# Altium schematic sheet Measurment ICs.SchDoc
size 420 x 297 mm; SheetNumber: 3; SheetTotal: 4
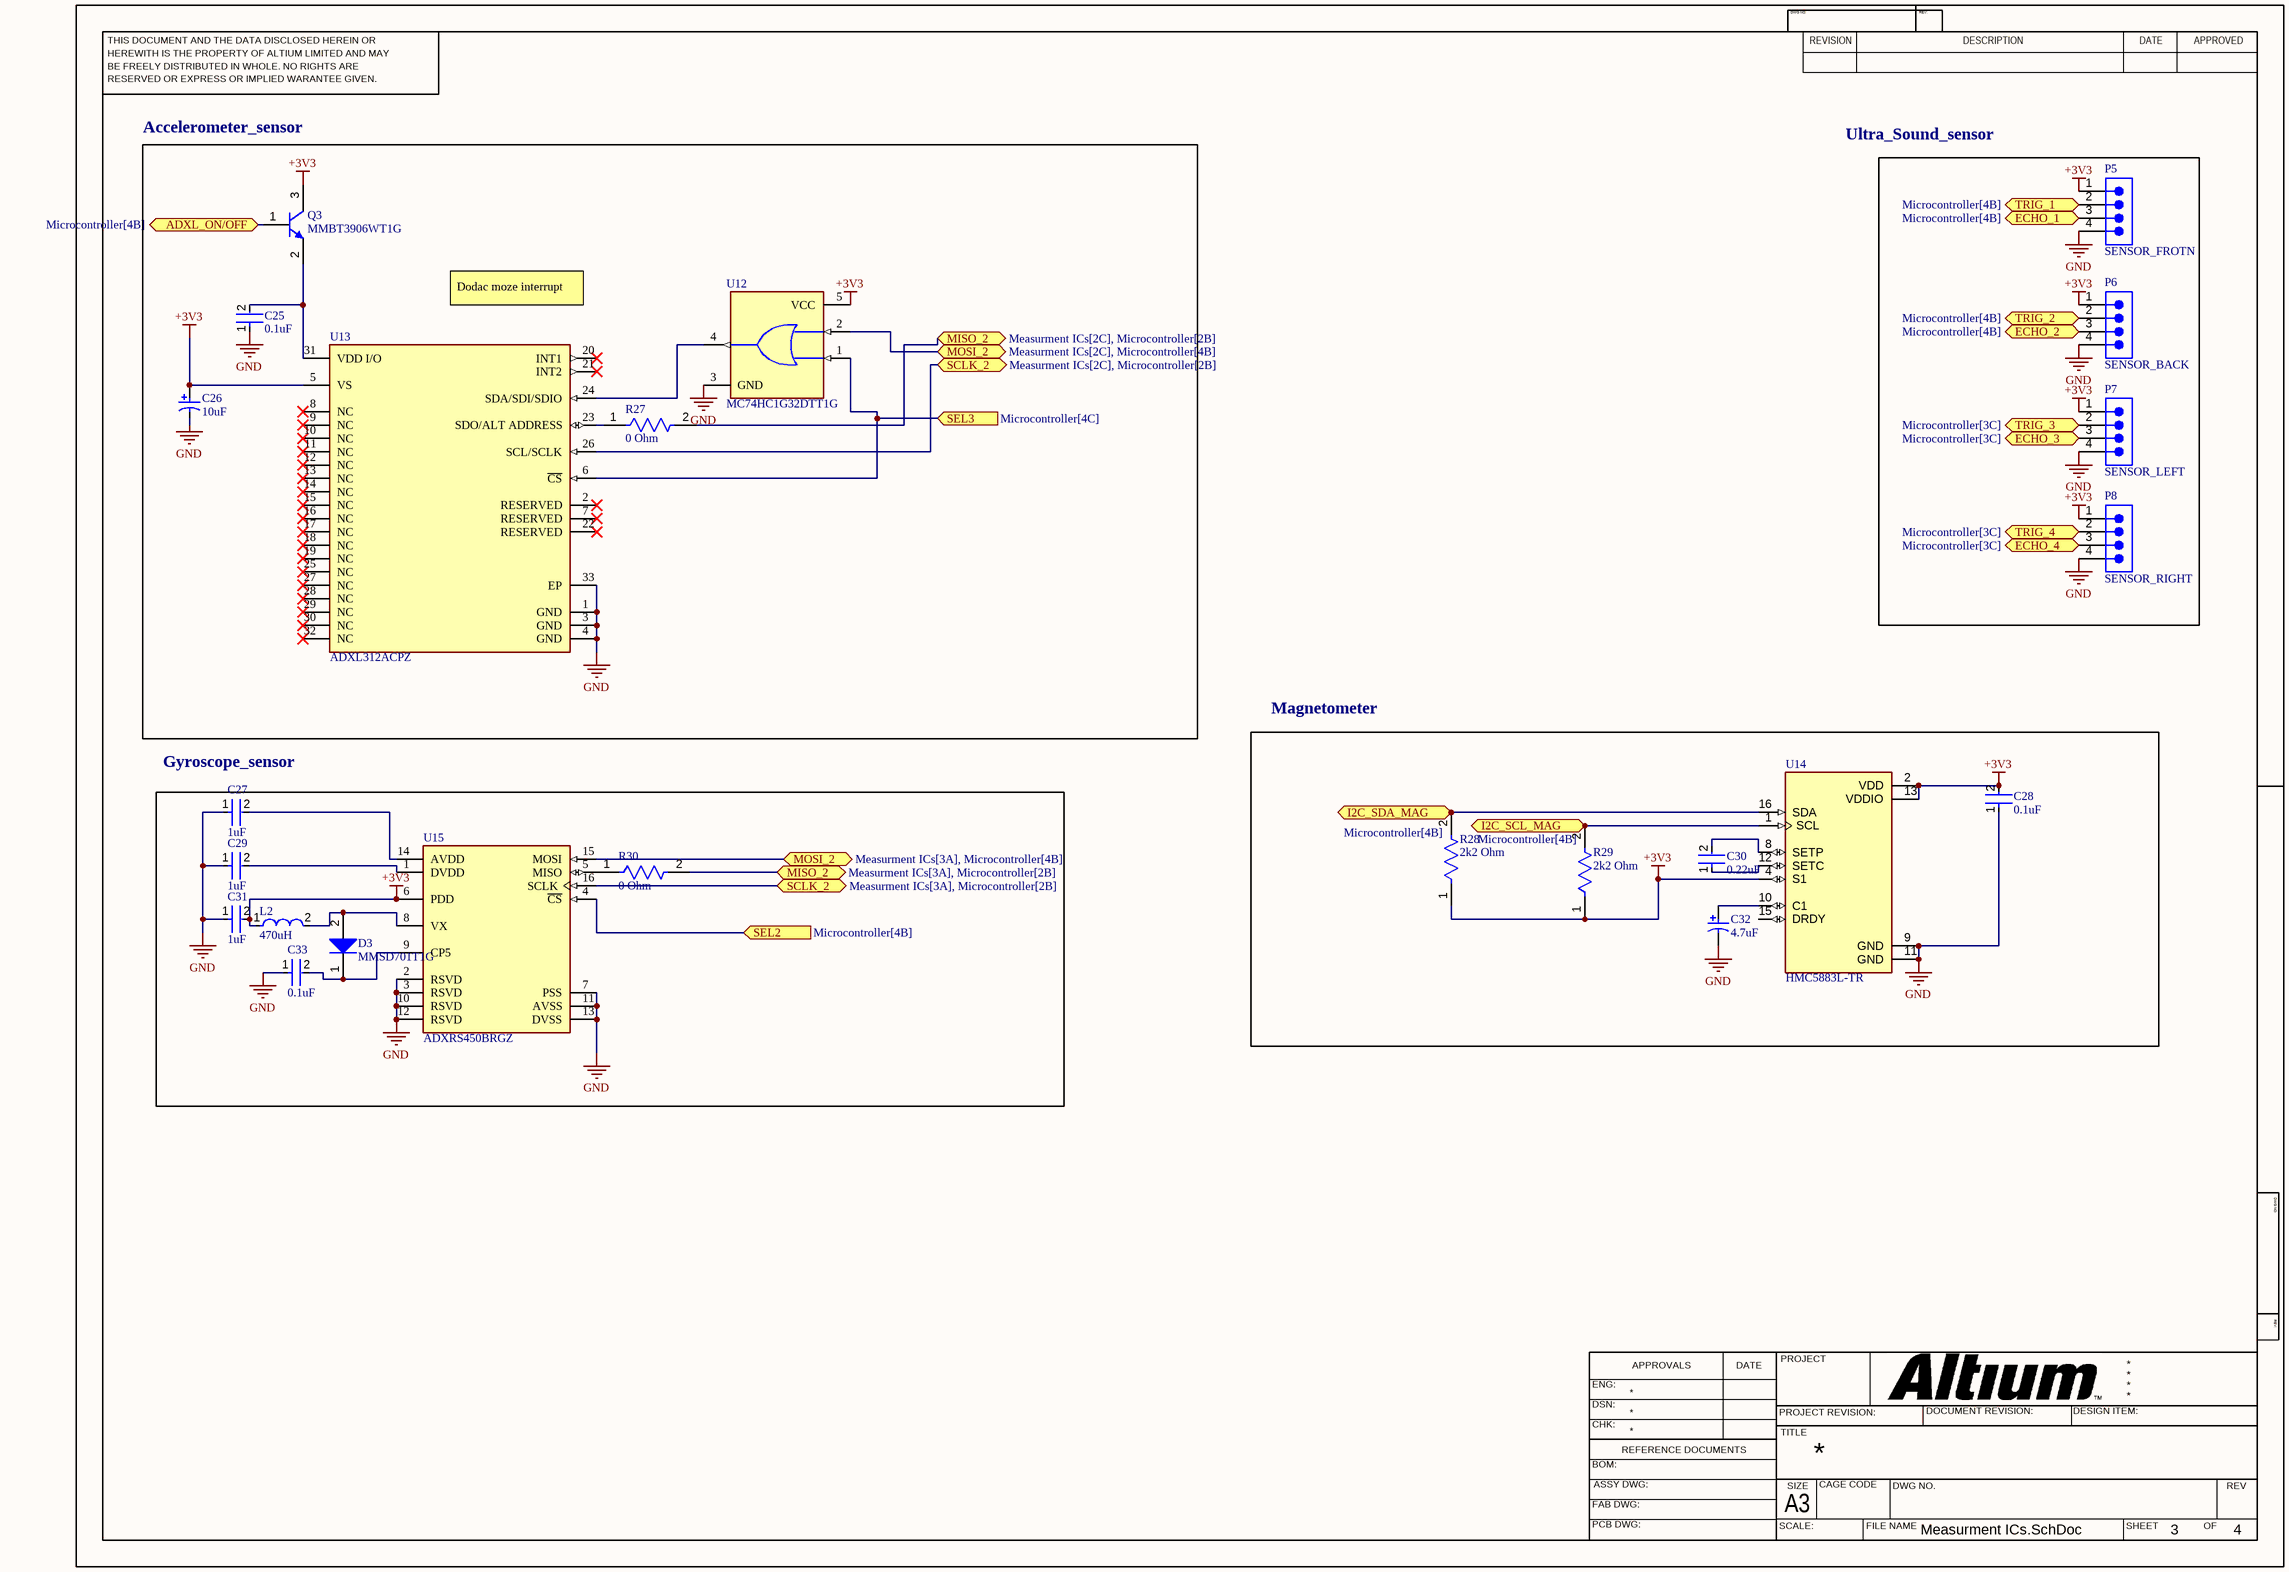
[diagram p0: Measurment ICs.SchDoc]

## Parts
C25  0.1uF  [FP-CC0805-0_85-MFG]
C26  10uF  [KEMT-A-3216-18-2_M]
C27  1uF  [FP-CC0805-0_85-MFG]
C28  0.1uF  [FP-CC0805-0_85-MFG]
C29  1uF  [FP-CC0805-0_85-MFG]
C30  0.22uF  [FP-CC0805-0_85-MFG]
C31  1uF  [FP-CC0805-0_85-MFG]
C32  4.7uF  [PNSC-FK-V-D8_V]
C33  0.1uF  [FP-CC0805-0_85-MFG]
D3  MMSD701T1G  [ONSC-SOD-123-2-425-04_V]
L2  470uH  [FP-CB2518-MFG]
P5  SENSOR_FROTN  [61300411121]
P6  SENSOR_BACK  [61300411121]
P7  SENSOR_LEFT  [61300411121]
P8  SENSOR_RIGHT  [61300411121]
Q3  MMBT3906WT1G  [ONSC-SC-70-3-419-04_V]
R27  0 Ohm  [FP-RMCF0805-MFG]
R28  2k2 Ohm  [FP-RMCF0805-MFG]
R29  2k2 Ohm  [FP-RMCF0805-MFG]
R30  0 Ohm  [FP-RMCF0805-MFG]
U12  MC74HC1G32DTT1G  [FP-483-MFG]
U13  ADXL312ACPZ  [FP-CP-32-17-MFG]
U14  HMC5883L-TR  [XDCR_HMC5883L-TR]
U15  ADXRS450BRGZ  [FP-RG-16-1-IPC_C]

## Blocks framed on the sheet
Magnetometer: C28 C30 C32 R28 R29 U14

## Ports
ADXL_ON/OFF (bidir, see Microcontroller[4B]), ECHO_1 (bidir, see Microcontroller[4B]), ECHO_2 (bidir, see Microcontroller[4B]), ECHO_3 (bidir, see Microcontroller[3C]), ECHO_4 (bidir, see Microcontroller[3C]), I2C_SCL_MAG (bidir, see Microcontroller[4B]), I2C_SDA_MAG (bidir, see Microcontroller[4B]), MISO_2 (bidir, see Measurment ICs[2C], Microcontroller[2B]), MISO_2 (bidir, see Measurment ICs[3A], Microcontroller[2B]), MOSI_2 (bidir, see Measurment ICs[2C], Microcontroller[4B]), MOSI_2 (bidir, see Measurment ICs[3A], Microcontroller[4B]), SCLK_2 (bidir, see Measurment ICs[2C], Microcontroller[2B]), SCLK_2 (bidir, see Measurment ICs[3A], Microcontroller[2B]), SEL2 (in, see Microcontroller[4B]), SEL3 (in, see Microcontroller[4C]), TRIG_1 (bidir, see Microcontroller[4B]), TRIG_2 (bidir, see Microcontroller[4B]), TRIG_3 (bidir, see Microcontroller[3C]), TRIG_4 (bidir, see Microcontroller[3C])

## Nets
+3V3: C26.1 C28.2 C31.2 L2.1 P5.1 P6.1 P7.1 P8.1 Q3.3(C) R28.1 R29.1 U12.5(VCC) U13.5(VS) U14.2(VDD) U14.4(S1) U14.13(VDDIO) U15.6(PDD)
GND: C25.1 C26.2 C27.1 C28.1 C29.1 C31.1 C32.2 C33.1 P5.4 P6.4 P7.4 P8.4 U12.3(GND) U13.1(GND) U13.3(GND) U13.4(GND) U13.33(EP) U14.9(GND) U14.11(GND) U15.2(RSVD) U15.3(RSVD) U15.7(PSS) U15.10(RSVD) U15.11(AVSS) U15.12(RSVD) U15.13(DVSS)
ADXL_ON/OFF: Q3.1(B) ; port ADXL_ON/OFF
ECHO_1: P5.3 ; port ECHO_1
ECHO_2: P6.3 ; port ECHO_2
ECHO_3: P7.3 ; port ECHO_3
ECHO_4: P8.3 ; port ECHO_4
I2C_SCL_MAG: R29.2 U14.1(SCL) ; port I2C_SCL_MAG
I2C_SDA_MAG: R28.2 U14.16(SDA) ; port I2C_SDA_MAG
MISO_2: R27.2 R30.2 ; port MISO_2
MOSI_2: U12.2(A) U15.15(MOSI) ; port MOSI_2
SCLK_2: U13.26(SCL/SCLK) U15.16(SCLK) ; port SCLK_2
SEL2: U15.4(~{CS}) ; port SEL2
SEL3: U12.1(B) U13.6(~{CS}) ; port SEL3
TRIG_1: P5.2 ; port TRIG_1
TRIG_2: P6.2 ; port TRIG_2
TRIG_3: P7.2 ; port TRIG_3
TRIG_4: P8.2 ; port TRIG_4
NetC25_2: C25.2 Q3.2(E) U13.31(VDD_I/O)
NetC27_2: C27.2 U15.14(AVDD)
NetC29_2: C29.2 U15.1(DVDD)
NetC30_1: C30.1 U14.12(SETC)
NetC30_2: C30.2 U14.8(SETP)
NetC32_1: C32.1 U14.10(C1)
NetC33_2: C33.2 D3.1(K) U15.9(CP5)
NetD3_2: D3.2(A) L2.2 U15.8(VX)
NetR27_1: R27.1 U13.23(SDO/ALT_ADDRESS)
NetR30_1: R30.1 U15.5(MISO)
NetU12_4: U12.4(Y) U13.24(SDA/SDI/SDIO)

Not connected (* = marked no-connect by the designer): U13 2(RESERVED)* 7(RESERVED)* 8(NC)* 9(NC)* 10(NC)* 11(NC)* 12(NC)* 13(NC)* 14(NC)* 15(NC)* 16(NC)* 17(NC)* 18(NC)* 19(NC)* 20(INT1)* 21(INT2)* 22(RESERVED)* 25(NC)* 27(NC)* 28(NC)* 29(NC)* 30(NC)* 32(NC)*; U14 15(DRDY)

## Notes on the sheet
- Accelerometer_sensor
- Ultra_Sound_sensor
- Dodac moze interrupt
- (near C27) Gyroscope_sensor
- THIS DOCUMENT AND THE DATA DISCLOSED HEREIN OR
- HEREWITH IS THE PROPERTY OF ALTIUM LIMITED AND MAY
- DWG NO:
- REVISION
- REV:
- DESCRIPTION
- DATE
- APPROVED
- BE FREELY DISTRIBUTED IN WHOLE. NO RIGHTS ARE
- RESERVED OR EXPRESS OR IMPLIED WARANTEE GIVEN.
- ENG:
- APPROVALS
- PROJECT
- DSN:
- CHK:
- REFERENCE DOCUMENTS
- PROJECT REVISION:
- TITLE
- DOCUMENT REVISION:
- DESIGN ITEM:
- BOM:
- FAB DWG:
- PCB DWG:
- ASSY DWG:
- SCALE:
- A3
- SIZE
- CAGE CODE
- FILE NAME
- DWG NO.
- SHEET
- OF
- REV

## Library data of the parts
C25 C27-C31 C33 = CMP-2100-03606-3: CAP CER 0.1UF 50V X7R 0805; Manufacturer Part Number: CC0805KRX7R9BB104; Manufacturer: Yageo; Tolerance: 0.1; Capacitance: 100 nF; Value: 100 nF; Material: Ceramic; Device Class L1: Passive Components; ComponentLink2Description: Datasheet; Package: CC0805-0.85; Digikey Description: CAP CER 0.1UF 50V X7R 0805; Device Class L3: Ceramic Capacitors; Temperature: -30°C to +85°C; Temperature Characteristic: X7R; Voltage Rating: 50 V; Height: 0.95mm; RoHS: TRUE; Ipc Land Pattern Name: CAPC200125X85; Device Class L2: Capacitors; Category: Cap; Temperature Range Low: -30°C; Temperature Range High: +85°C; Mouser Description: Multilayer Ceramic Capacitors MLCC - SMD/SMT 100nF 50V X7R 10%; Footprint Url: http://www.yageo.com/exep/pages/download/literatures/UPY-C_GEN_24.pdf; Automotive: No; Octopart: https://octopart.com/cc0805krx7r9bb104-yageo-192993; Lead Free: Yes; ComponentLink2URL: http://www.yageo.com/documents/recent/UPY-GPHC_Y5V_6.3V-to-50V_8.pdf
C26 = CMP-2000-05172-1: Capacitor, Tantalum, 10 uF, +/- 10%, 10 V, -55 to 125 degC, 2-Pin SMD (1206), RoHS, Tape and Reel; Manufacturer Size Code: A; Manufacturer: Kemet; Type: Molded; Online Catalog: T491Series; Other Names: 399-3684-2; Voltage - Rated: 10V; Lifetime @ Temp.: 2000Hrs@85degC; Product Training Modules: CapacitorBasics-TypicalUsesforCapacitorsDeratingGuidelinesforSurfaceMountTantalumCapacitors; ESR (Equivalent Series Resistance): 3.8Ohm; Capacitance: 10µF; Catalog Drawings: T49x,T5xxSeries_A-side1T49x,T5xxSeries_A,B-side2T49x,T5xxSeries_A,SBottom; Family: TantalumCapacitors; Manufacturer URL: http://www.kemet.com/; Datasheet URL: http://www.farnell.com/datasheets/1824869.pdf; Package Reference: 1206; Packaging: Tape&Reel(TR); Series: T491; Operating Temperature: -55degC~125degC; Mounting Type: SurfaceMount; Height - Seated (Max): 0.071"(1.80mm); Package / Case: 1206(3216Metric); Package Description: 2-Pin Surface Mount Device, Body 3.2 x 1.6 mm; Features: GeneralPurpose; Tolerance: ±10%; Lead Spacing: -; Size / Dimension: 0.126"Lx0.063"W(3.20mmx1.60mm); Standard Package: 2,000; Datasheet Version: Apr-14; Category: Capacitors
C32 = CMP-2000-06206-1: Aluminum Electrolytic Capacitor, 100 uF, +/- 20%, 25 V, 2-Pin SMD (Size Code D8), -55 to 105 degC, RoHS, Tape and Reel; Manufacturer: Panasonic; Type: Can; Lifetime@Temperature: 2000Hrs@105°C; Capacitance: 100µF; Rated Voltage: 25V; Ripple Current: 280mA; Impedance: 0.34O; Case Size/Dimension: Ø6.3x7.7mm; Operating Temp-Max: 105°C; Series: FK; Package URL: http://industrial.panasonic.com/cdbs/www-data/pdf/RDE0000/DME0000COL48.pdf; Mounting Technology: SurfaceMount; Package Description: 2-Pin Electrolytic Aluminum Capacitor, Body 6.6 x 6.6 mm; Datasheet Version: 03/2016; Datasheet URL: http://industrial.panasonic.com/cdbs/www-data/pdf/RDE0000/ABA0000C1181.pdf; Manufacturer URL: http://www.panasonic.com/; Package Reference: FK-V-D8; Operating Temp Range: -55to+105°C
D3 = CMP-1055-00417-1: Schottky Barrier Diode, 2-Pin SOD-123, Pb-Free, Tape and Reel; Manufacturer: On Semiconductor; Configuration: Single; Packing: Tape and Reel; PackageDescription: 2-Pin SOD, Body 1.6 x 2.69 mm; DatasheetVersion: Rev. 6; ComponentLink1URL: http://www.onsemi.com/; PackageReference: SOD-123-2-425-04; ComponentLink2Description: Datasheet; ComponentLink2URL: http://www.onsemi.cn/pub_link/Collateral/MMSD301T1-D.PDF; ComponentLink1Description: Manufacturer URL; PackageVersion: Rev. G, 10/2009; Mounting Technology: Surface Mount; PartNumber: MMSD701T1G; ComponentLink3URL: http://www.onsemi.com/pub_link/Collateral/425-04.PDF; ComponentLink3Description: Package Specification; RoHS: TRUE
L2 = CMP-14484-000283-1: SMD Inductors 470uH ±20% 0.07A 28.6Ω 1007; Shielding: Unshielded; DC Resistance (DCR): 28.6R; Current Rating: 70mA; Core Material: Ferrite; Saturation Current: 80mA; Test Frequency: 796kHz; Self Resonant Frequency: 3.5MHz; Packaging: Tape and Reel; Mount: Surface Mount; Case/Package: 1007; Min Operating Temperature: -40°C; Military Standard: Not; RoHS Compliant: Yes; Resistance: 28.6R; Height - Seated (Max): 0.079inch; Case Code (Imperial): 1007; Inductance: 470uH; Max Operating Temperature: 105°C; Halogen Free: Halogen Free; Package Quantity: 2000; Series: CB; Case Code (Metric): 2518; Width: 0.071inch; Resistor Type: Wirewound; Tolerance: 20%; Height: 1.8mm; Depth: 2mm; Termination: SMD/SMT; DC Current: 70mA; Radiation Hardening: No; Max DC Current: 80mA; Lead Free: Lead Free; Length: 0.098inch
P5-P8 = CMP-1502-01064-3: NexarPartId: 32855522; Operating Supply Voltage: 250V; Pitch: 2.54mm; Contact Resistance: 20mΩ; Number of Positions: 4; Current Rating: 3A; Connector Type: Male Pin; Gender: Male; Contact Plating: Gold; Height: 8.89mm; Lead Pitch: 2.54mm; Lead Free: Lead Free; Contact Mating Length: 5.9944mm; Number of Rows: 1; Termination: Solder; Packaging: Bulk; REACH SVHC: Unknown; Min Operating Temperature: -40°C; RoHS: Compliant; Number of Contacts: 4; Voltage Rating: 250V; Color: Black; Max Operating Temperature: 105°C; Contact Material: Copper; Mount: Through Hole; Orientation: Vertical; Number of Pins: 4
Q3 = CMP-1048-00381-1: General Purpose Transistor, PNP Silicon, 3-Pin SC70, Pb-Free, Tape and Reel; Manufacturer: On Semiconductor; IC Continuous (A): -0.2; fT Min (MHz): 250; PackageDescription: 3-Pin Small Outline Transistor, Body 2 x 1.25 mm, Pitch 0.65 mm; PartNumber: MMBT3906WT1G; ComponentLink2Description: Datasheet; Packing: Tape and Reel; Mounting Technology: Surface Mount; ComponentLink3Description: Package Specification; DatasheetVersion: Rev. 8; ComponentLink2URL: http://www.onsemi.cn/pub_link/Collateral/MMBT3904WT1-D.PDF; Polarity: PNP; ComponentLink3URL: http://www.onsemi.cn/pub_link/Collateral/419-04.PDF; ComponentLink1Description: Manufacturer URL; PackageReference: SC-70-3-419-04; ComponentLink1URL: http://www.onsemi.com/; RoHS: TRUE; PackageVersion: Rev. N, 11/2008
R27-R30 = CMP-26527-000017-1: RES 0 OHM JUMPER 1/8W 0805; Power Rating: 125mW; Resistance: 0mR; Depth: 1.25mm; Length: 2mm; Military Standard: Not; Width: 0.049inch; Case Code (Imperial): 0805; Number of Terminations: 2; Mount: Surface Mount; Contact Plating: Tin; Height: 0.026inch; Case/Package: 0805; Min Operating Temperature: -55°C; Composition: Thick Film; Max Operating Temperature: 155°C; Packaging: Tape and Reel; Features: Automotive AEC-Q200; Max Power Dissipation: 125mW; Radiation Hardening: No; Lead Free: Lead Free; Case Code (Metric): 2012
U12 = CMP-00278-00467123-1: MC74HC1G32DTT1G MC74HC Series 4 V Surface Mount Single 2-Input OR Gate - TSOP-5; NexarPartId: 467123; Manufacturer Lifecycle Status: ACTIVE; Low Level Output Current: 2.6mA; Schmitt Trigger Input: No; Propagation Delay: 7ns; High Level Output Current: -2.6mA; Number of Elements: 1; Number of Inputs: 2; Turn-On Delay Time: 100ns; Min Supply Voltage: 2V; Quiescent Current: 1µA; Max Junction Temperature (Tj): 150°C; Operating Supply Voltage: 4V; Max Supply Voltage: 6V; Min Operating Temperature: -55°C; Output Current: 2.6mA; Number of Pins: 5; Contact Plating: Tin; Case/Package: TSOP; Max Operating Temperature: 125°C; RoHS: Compliant; Number of Circuits: 1; Lifecycle Status: Production; Packaging: Tape & Reel (TR); Width: 1.5mm; Radiation Hardening: No; Number of Gates: 1; Ambient Temperature Range High: 125°C; Lead Free: Lead Free; Schedule B: 8542390000, 8542390000; Number of Outputs: 1; Number of Channels: 1; REACH SVHC: No SVHC; Mount: Surface Mount; Logic Function: OR; Halogen Free: Halogen Free; Height: 1mm; Length: 3mm
U13 = CMP-0885-00061-2: ACCEL 1.5-12G I2C/SPI 32LFCSP; Supply Current: 170uA; Interface: I2C; Sensitivity: 345LSB/g; Output Type: Digital; Axis: X, Y, Z; Min Supply Voltage: 2V; Bandwidth: 3.125Hz; -3db Bandwidth: 1.6kHz; Max Supply Voltage: 3.6V; Packaging: Rail/Tube; REACH SVHC: No SVHC; Operating Supply Current: 170uA; Radiation Hardening: No; Nominal Supply Current: 170uA; Case/Package: LFCSP EP; Series: -; Lead Free: Contains Lead; Length: 5mm; Max Operating Temperature: 105°C; Number of Pins: 32; Depth: 5mm; Contact Plating: Tin; Package Quantity: 60; RoHS Compliant: Yes; Min Operating Temperature: -40°C; Height: 1.5mm; Width: 5.1mm
U14 = HMC5883L-TR: Board Mount Hall Effect / Magnetic Sensors Sensors, Transducers Magnetic - Hall Effect, Digital Switch, Linear, Compass (ICs) - IC COMPASS 3 AXIS I2C 16LCC SMD; MF: STMicroelectronics; MP: HMC5883LTR; Price: None; SnapEDA_Link: https://www.snapeda.com/parts/HMC5883LTR/STMicroelectronics/view-part/?ref=snap; Check_prices: https://www.snapeda.com/parts/HMC5883LTR/STMicroelectronics/view-part/?ref=eda; Package: LCC-16 STMicroelectronics; Availability: Not in stock; Value: *
U15 = CMP-09161-000004-1: SENS GYRO 300DEG/S DGTL 16SOIC; Bandwidth: 80Hz; Output Type: SPI; Max Supply Voltage: 5.25V; Resolution: 16b; Operating Supply Current: 6mA; Min Supply Voltage: 3.15V; Axis: Z; Linearity: 99.75%; Packaging: Rail/Tube; Max Operating Temperature: 105°C; Width: 7.8mm; Min Operating Temperature: -40°C; Series: -; RoHS Compliant: Yes; Lead Free: Contains Lead; Mount: Surface Mount; Package Quantity: 1; Supply Current: 6mA; Interface: SPI; Length: 10.3mm; -3db Bandwidth: 80Hz; Case/Package: SOIC; Height: 3.73mm; Nominal Supply Current: 6mA; REACH SVHC: No SVHC; Number of Pins: 16